# EAGLE design Lab5 (EAGLE 9.6.2)
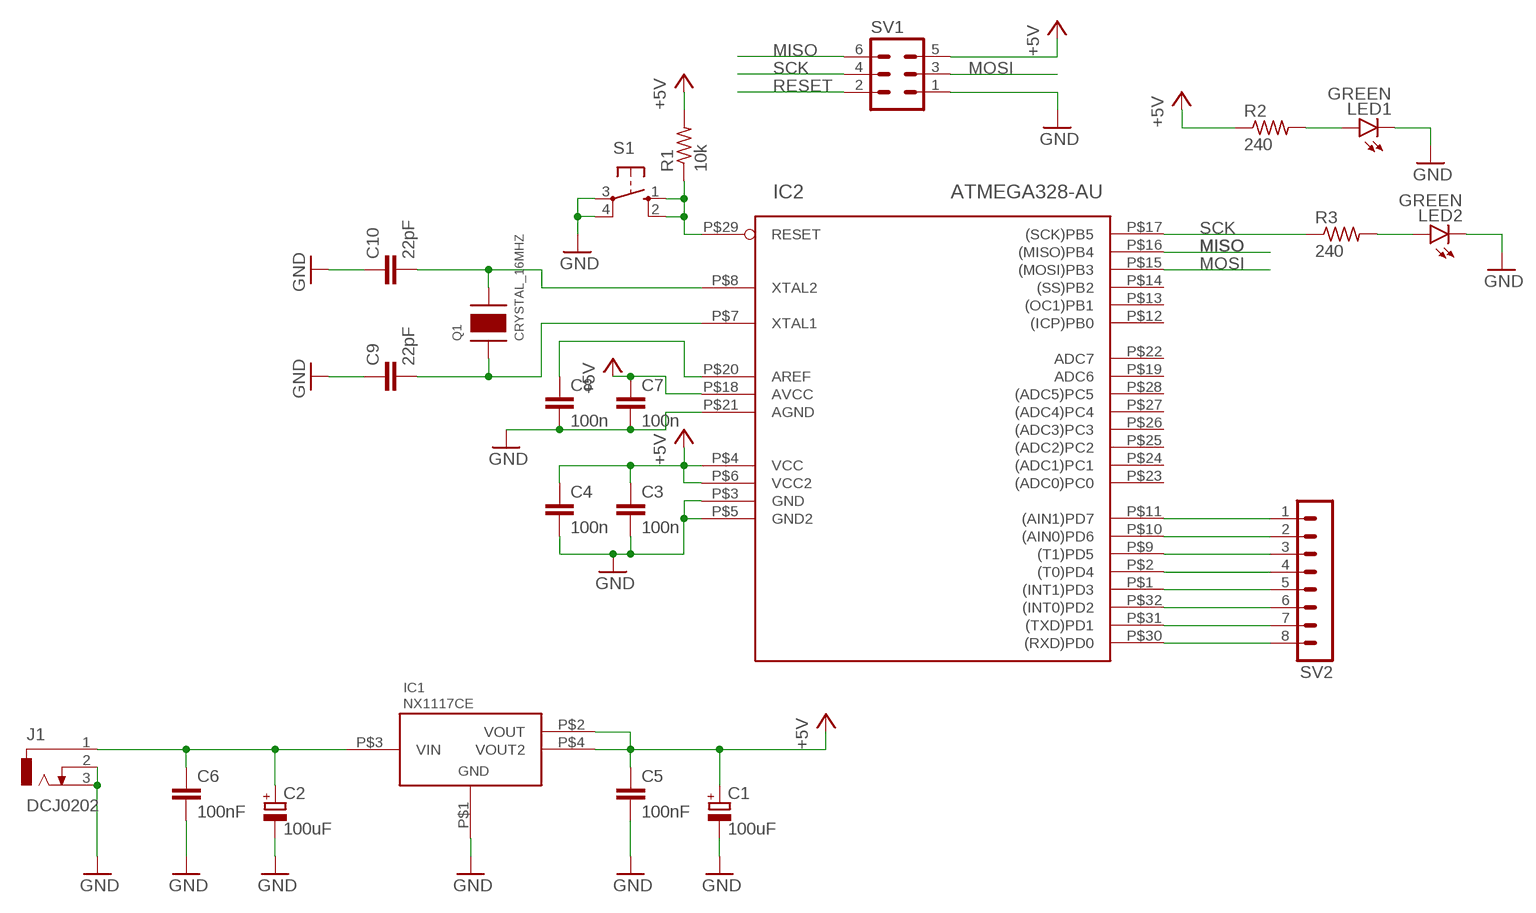
[diagram p0: schematic, sheet 1]

## Parts
C1  100uF  CPOL-EUD  [PANASONIC_D]
C2  100uF  CPOL-EUD  [PANASONIC_D]
C3  100n  C-EUC0603  [C0603]
C4  100n  C-EUC0603  [C0603]
C5  100nF  C-EUC0805  [C0805]
C6  100nF  C-EUC0805  [C0805]
C7  100n  C-EUC0603  [C0603]
C8  100n  C-EUC0603  [C0603]
C9  22pF  C-EUC0603  [C0603]
C10  22pF  C-EUC0603  [C0603]
IC1  NX1117CE  [SOT223_NX]
IC2  ATMEGA328-AU  [32-TQFP]
J1  DCJ0202  [DCJ0202]
LED1  GREEN  LEDCHIP-LED0603  [CHIP-LED0603]
LED2  GREEN  LEDCHIP-LED0603  [CHIP-LED0603]
Q1  CRYSTAL_16MHZ  [CRYSTAL_16MHZ]
R1  10k  R-US_R0603  [R0603]
R2  240  R-US_R0603  [R0603]
R3  240  R-US_R0603  [R0603]
S1  10-XX  [B3F-10XX]
SV1  MA03-2  [MA03-2]
SV2  MA08-1  [MA08-1]

## Nets
+5V: C1.+ C3.1 C4.1 C5.1 C7.1 IC1.P$2(VOUT) IC1.P$4(VOUT2) IC2.P$4(VCC) IC2.P$6(VCC2) IC2.P$18(AVCC) R1.2 R2.1 SV1.5
GND: C1.- C2.- C3.2 C4.2 C5.2 C6.2 C7.2 C8.2 C9.1 C10.1 IC1.P$1(GND) IC2.P$3(GND) IC2.P$5(GND2) IC2.P$21(AGND) J1.2 J1.3 LED1.C LED2.C S1.3(P) S1.4(P1) SV1.1
MISO: IC2.P$16((MISO)PB4) SV1.6
MOSI: IC2.P$15((MOSI)PB3) SV1.3
N$1: C2.+ C6.1 IC1.P$3(VIN) J1.1
N$2: C8.1 IC2.P$20(AREF)
N$3: C9.2 IC2.P$7(XTAL1) Q1.P$1
N$4: C10.2 IC2.P$8(XTAL2) Q1.P$2
N$5: IC2.P$29(RESET) R1.1 S1.1(S) S1.2(S1)
N$6: LED1.A R2.2
N$7: LED2.A R3.2
N$9: IC2.P$11((AIN1)PD7) SV2.1
N$10: IC2.P$10((AIN0)PD6) SV2.2
N$11: IC2.P$9((T1)PD5) SV2.3
N$12: IC2.P$2((T0)PD4) SV2.4
N$13: IC2.P$1((INT1)PD3) SV2.5
N$14: IC2.P$32((INT0)PD2) SV2.6
N$15: IC2.P$31((TXD)PD1) SV2.7
N$16: IC2.P$30((RXD)PD0) SV2.8
RESET: SV1.2
SCK: IC2.P$17((SCK)PB5) R3.1 SV1.4
Unconnected: IC2.P$12((ICP)PB0) IC2.P$13((OC1)PB1) IC2.P$14((SS)PB2) IC2.P$19(ADC6) IC2.P$22(ADC7) IC2.P$23((ADC0)PC0) IC2.P$24((ADC1)PC1) IC2.P$25((ADC2)PC2) IC2.P$26((ADC3)PC3) IC2.P$27((ADC4)PC4) IC2.P$28((ADC5)PC5)

## Library data of the parts
C1 C2 = rcl:CPOL-EU: POLARIZED CAPACITOR, European symbol; SPICEPREFIX: C
C3-C10 = rcl:C-EU: CAPACITOR, European symbol; SPICEPREFIX: C
IC1 = SPLAB:NX1117CE; DIGIKEY: MC33269DT-5.0GOS-ND
IC2 = SPLAB:ATMEGA328-AU; DIGIKEY: ATMEGA328-AU-ND
J1 = con-jack:DCJ0202: DC POWER JACK Source: DCJ0202.pdf; OC_FARNELL: unknown; OC_NEWARK: unknown
LED1 LED2 = led:LED: LED OSRAM: - CHIPLED LG R971, LG N971, LY N971, LG Q971, LY Q971, LO R971, LY R971 LH N974, LH R974 LS Q976, LO Q976, LY Q976 LO Q996 - Hyper CHIPLED LW Q18S LB Q993, LB Q99A, LB R99A - SideLED LS A670, LO A670, LY A670, LG A670, LP A670 LB A673, LV A673, LT A673, LW A673 LH A674 LY A675 LS A676, LA A676, LO A676, LY A676, LW A676 LS A679, LY A679, LG A679 - Hyper Micro SIDELED® LS Y876, LA Y876, LO Y876, LY Y876 LT Y87S - SmartLED LW L88C, LW L88S LB L89C, LB L89S, LG L890 LS L89K, LO L89K, LY L89K LS L896, LA L896, LO L896, LY L896 - TOPLED LS T670, LO T670, LY T670, LG T670, LP T670 LSG T670, LSP T670, LSY T670, LOP T670, LYG T670 LG T671, LOG T671, LSG T671 LB T673, LV T673, LT T673, LW T673 LH T674 LS T676, LA T676, LO T676, LY T676, LB T676, LH T676, LSB T676, LW T676 LB T67C, LV T67C, LT T67C, LS T67K, LO T67K, LY T67K, LW E67C LS E67B, LA E67B, LO E67B, LY E67B, LB E67C, LV E67C, LT E67C LW T67C LS T679, LY T679, LG T679 LS T770, LO T770, LY T770, LG T770, LP T770 LB T773, LV T773, LT T773, LW T773 LH T774 LS E675, LA E675, LY E675, LS T675 LS T776, LA T776, LO T776, LY T776, LB T776 LHGB T686 LT T68C, LB T68C - Hyper Mini TOPLED® LB M676 - Mini TOPLED Santana® LG M470 LS M47K, LO M47K, LY M47K Source: http://www.osram.convergy.de LUXEON: - LUMILED® LXK2-PW12-R00, LXK2-PW12-S00, LXK2-PW14-U00, LXK2-PW14-V00 LXK2-PM12-R00, LXK2-PM12-S00, LXK2-PM14-U00 LXK2-PE12-Q00, LXK2-PE12-R00, LXK2-PE12-S00, LXK2-PE14-T00, LXK2-PE14-U00 LXK2-PB12-K00, LXK2-PB12-L00, LXK2-PB12-M00, LXK2-PB14-N00, LXK2-PB14-P00, LXK2-PB14-Q00 LXK2-PR12-L00, LXK2-PR12-M00, LXK2-PR14-Q00, LXK2-PR14-R00 LXK2-PD12-Q00, LXK2-PD12-R00, LXK2-PD12-S00 LXK2-PH12-R00, LXK2-PH12-S00 LXK2-PL12-P00, LXK2-PL12-Q00, LXK2-PL12-R00 Source: www.luxeon.com KINGBRIGHT: KA-3528ASYC Source: www.kingbright.com
Q1 = SPLAB:CRYSTAL_16MHZ
R1-R3 = rcl:R-US_: RESISTOR, American symbol; SPICEPREFIX: R
S1 = switch-omron:10-XX: OMRON SWITCH; MPN: B3F-1000; OC_FARNELL: 176432; OC_NEWARK: 36M3542
SV1 = con-lstb:MA03-2: PIN HEADER; OC_FARNELL: unknown; OC_NEWARK: unknown
SV2 = con-lstb:MA08-1: PIN HEADER; OC_FARNELL: unknown; OC_NEWARK: unknown

## Board
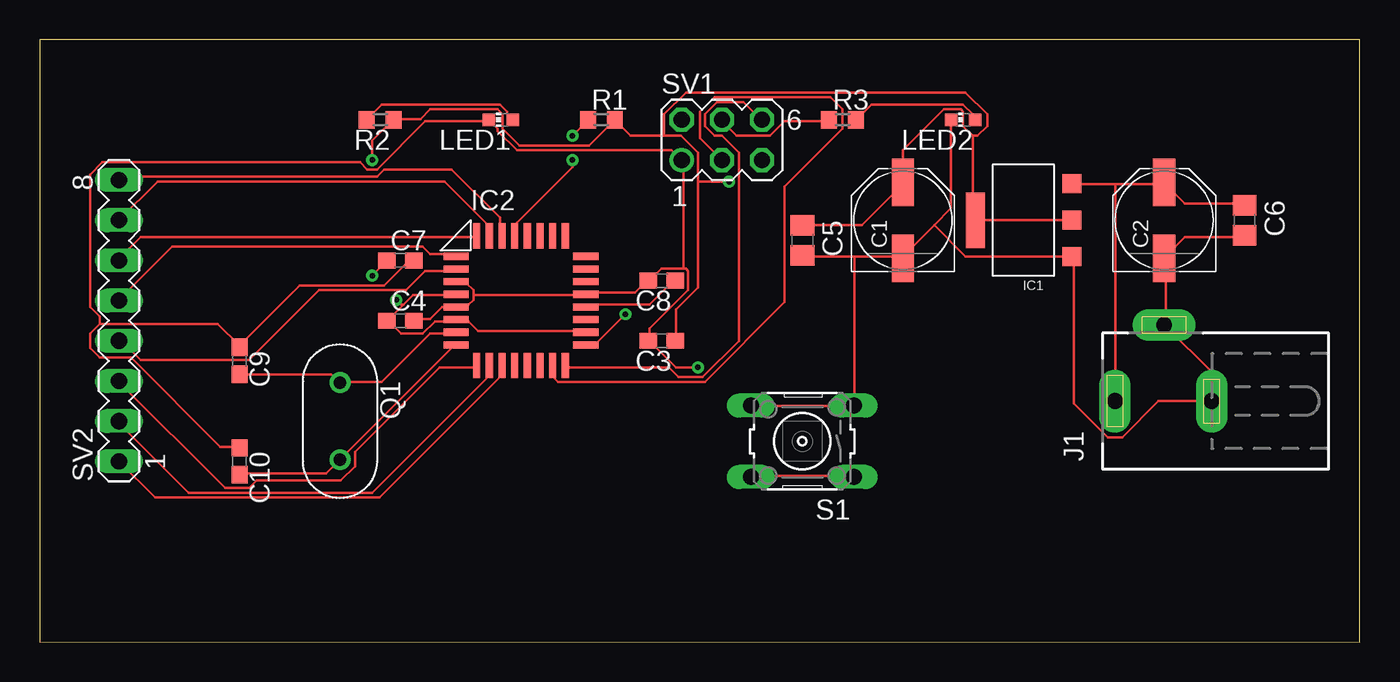
[diagram p1: board, top side]
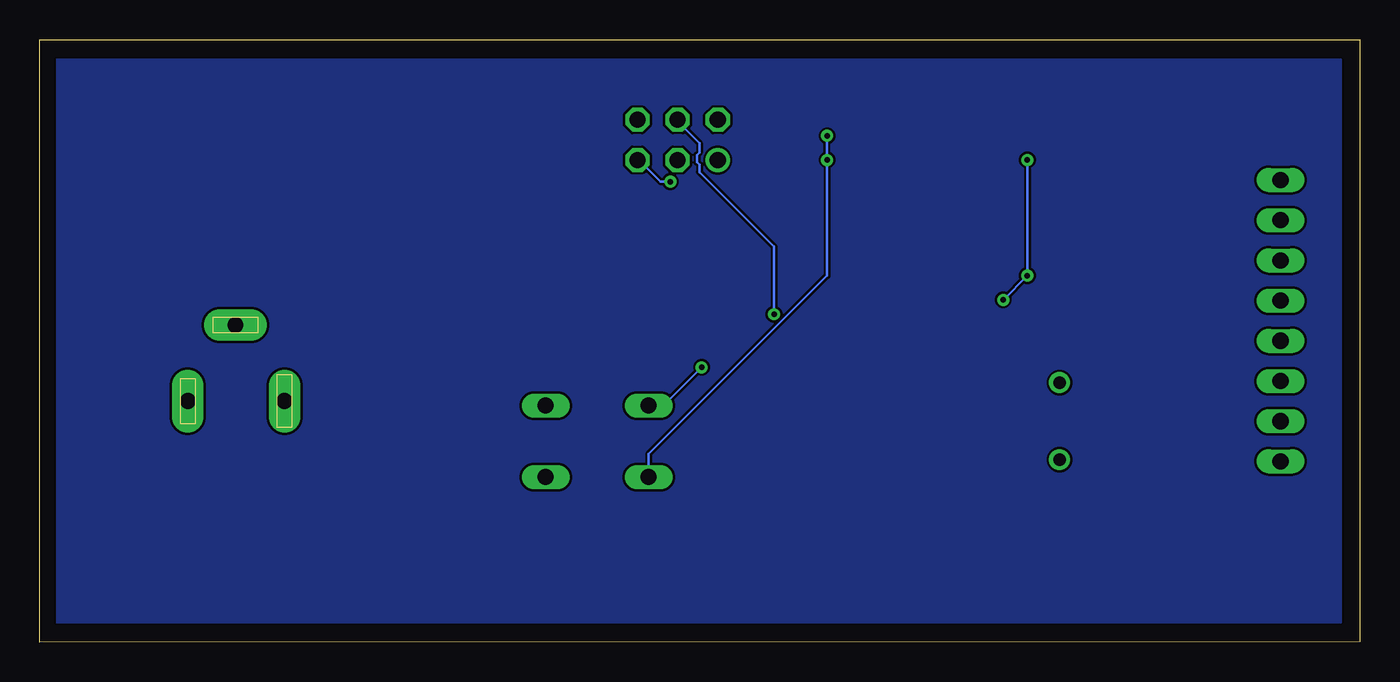
[diagram p2: board, bottom side, seen from below]

Size 83.42 x 38.09 mm. Coordinates in mm from the lower left corner, seen from the top.
Outline: 0,0.03 83.42,0 83.42,38.09 0,38.09 0,0.03
Copper layers (1*16): Top 0.035mm / dielectric 1.5mm / Bottom 0.035mm
Design rules "default": minimum track width 6mil, minimum drill 0.35mm, track to track 6mil, track to pad 6mil, pad to pad 6mil, via to via 6mil, smd to smd 6mil, copper to edge 40mil, drill to drill 6mil, minimum pad ring 10mil, minimum via ring 8mil, stop-mask expansion 4mil, vias tented up to drill 0mil, thermal gap 10mil

### Footprints (pad centres in the part's own frame; a part is rotated, then mirrored left to right if it is on the bottom)
PANASONIC_D = smd 3 x 1.4: + 2.4,0; - -2.4,0
C0603 = smd 1.1 x 1: 1 -0.85,0; 2 0.85,0
C0805 = smd 1.3 x 1.5: 1 -0.95,0; 2 0.95,0
SOT223_NX = smd 1.2 x 1.2: P$1 -2.3,-3.05; P$2 0,-3.05; P$3 2.3,-3.05 | smd 3.5 x 1.2: P$4 0,3.05
32-TQFP = smd 1.6 x 0.45: P$1 -4.1,2.8; P$2 -4.1,2; P$3 -4.1,1.2; P$4 -4.1,0.4; P$5 -4.1,-0.4; P$6 -4.1,-1.2; P$7 -4.1,-2; P$8 -4.1,-2.8; P$17 4.1,-2.8; P$18 4.1,-2; P$19 4.1,-1.2; P$20 4.1,-0.4; P$21 4.1,0.4; P$22 4.1,1.2; P$23 4.1,2; P$24 4.1,2.8 | smd 0.45 x 1.6: P$9 -2.8,-4.1; P$10 -2,-4.1; P$11 -1.2,-4.1; P$12 -0.4,-4.1; P$13 0.4,-4.1; P$14 1.2,-4.1; P$15 2,-4.1; P$16 2.8,-4.1; P$25 2.8,4.1; P$26 2,4.1; P$27 1.2,4.1; P$28 0.4,4.1; P$29 -0.4,4.1; P$30 -1.2,4.1; P$31 -2,4.1; P$32 -2.8,4.1
DCJ0202 = drill 1 pad 2 long: 1 0,3.1; 2 4.8,0; 3 0,-3
CHIP-LED0603 = smd 0.8 x 0.8: A 0,-0.75; C 0,0.75
CRYSTAL_16MHZ = drill 0.8: P$1 -2.44,0; P$2 2.44,0
R0603 = smd 1 x 1.1: 1 -0.85,0; 2 0.85,0
B3F-10XX = drill 1.016 long: 1 -3.251,2.261; 2 3.251,2.261; 3 -3.251,-2.261; 4 3.251,-2.261
MA03-2 = drill 1.016: 1 -2.54,-1.27 | drill 1.016 octagon: 2 -2.54,1.27; 3 0,-1.27; 4 0,1.27; 5 2.54,-1.27; 6 2.54,1.27
MA08-1 = drill 1.016 long: 1 -8.89,0; 2 -6.35,0; 3 -3.81,0; 4 -1.27,0; 5 1.27,0; 6 3.81,0; 7 6.35,0; 8 8.89,0

### Placement (x,y rotation side)
C1  54.54,26.67 90 top
C2  71.05,26.67 90 top
C3  39.3,19.05 180 top
C4  22.79,20.32 0 top
C5  48.19,25.4 270 top
C6  76.13,26.67 270 top
C7  22.79,24.13 0 top
C8  39.3,22.86 180 top
C9  12.63,17.78 270 top
C10  12.63,11.43 270 top
IC1  62.16,26.67 90 top
IC2  30.41,21.59 0 top
J1  71.05,15.24 90 top
LED1  29.14,33.02 90 top
LED2  58.35,33.02 90 top
Q1  18.98,13.97 270 top
R1  35.49,33.02 0 top
R2  21.52,33.02 180 top
R3  50.73,33.02 0 top
S1  48.19,12.7 180 top
SV1  43.11,31.75 0 top
SV2  5.01,20.32 90 top

### Tracks (layer width: path | path; a pad name or v marks a point on that pad's centre or on a via)
+5V  (via drill 0.35)
  Top 0.152: IC1.P$2 IC1.P$4 58.96,26.67 58.96,32 | C5.1 48.3,26.37 51.95,26.37 54.54,28.96 C1.+ 54.54,31.09 57.13,33.68 58.2,33.68 58.35,33.53 58.35,32.61 58.96,32 | 23,21.34 23.61,21.95 26.2,21.95 IC2.P$4 | 23,21.34 22.08,20.42 C4.1 22.08,20.27 22.84,19.51 24.22,19.51 24.98,20.27 26.2,20.27 IC2.P$6 26.35,20.27 27.11,20.27 27.72,19.66 34.43,19.66 IC2.P$18 | v21.02,23.16 21.93,24.08 C7.1 | v22.54,21.64 22.84,21.34 23,21.34 | 41.59,29.11 41.59,30.94 40.52,32 39.46,32 | 41.59,29.11 41.59,22.4 40.22,21.03 40.22,19.05 C3.1 | 39.46,32 37.32,32 36.41,32.92 R1.2 36.26,32.92 34.73,31.39 30.31,31.39 29.25,32.46 29.25,33.38 28.94,33.68 24.67,33.68 24.06,33.07 22.39,33.07 R2.1 22.23,32.92 21.02,31.7 v21.02,30.48 | 41.59,29.11 v43.57,29.11 | 58.96,32 59.27,32 59.88,32.61 59.88,33.38 58.51,34.75 40.83,34.75 39.46,33.38 39.46,32
  Bottom 0.152: v22.54,21.64 v21.02,23.16 v21.02,30.48 | v43.57,29.11 44.18,29.11 45.55,30.48 SV1.5
GND  (via drill 0.35)
  Top 0.152: C6.2 76.03,25.6 72.37,25.6 71.16,24.38 C2.- 71.16,24.23 71.16,20.12 J1.2 71.16,19.96 74.05,17.07 J1.3 | S1.4 44.94,14.94 51.34,14.94 S1.3 51.5,15.09 51.5,24.38 | 54.54,24.38 56.52,26.37 | 56.52,26.37 57.59,27.43 57.59,32.92 LED2.C | 56.52,26.37 58.51,24.38 65.21,24.38 IC1.P$1 65.36,24.23 65.36,15.09 67.5,12.95 68.41,12.95 70.7,15.24 J1.3 | 54.54,24.38 51.5,24.38 | 51.5,24.38 48.3,24.38 C5.2 | 54.54,24.38 C1.- | J1.3 | 3.79,20.12 3.18,19.51 3.18,18.59 3.79,17.98 5.78,17.98 11.41,12.34 12.63,12.34 C10.1 | 3.79,20.12 11.26,20.12 12.63,18.75 | 12.63,18.75 16.44,22.55 21.78,22.55 23.3,24.08 23.61,24.08 C7.2 | 12.63,18.75 C9.1 | C4.2 23.76,20.42 24.67,20.42 25.44,21.18 26.2,21.18 IC2.P$5 26.35,21.34 27.11,21.34 27.42,21.64 27.42,21.95 | 27.42,21.95 27.42,22.25 26.96,22.71 26.35,22.71 IC2.P$3 | 38.54,19.05 38.54,19.81 40.98,22.25 40.98,23.47 40.83,23.62 40.68,23.62 | 40.68,23.62 39.3,23.62 38.54,22.86 C8.2 38.39,22.86 37.63,22.1 34.58,22.1 IC2.P$21 34.43,21.95 27.42,21.95 | 40.68,23.62 40.68,30.48 SV1.1 40.52,30.48 39.91,31.09 30.16,31.09 28.94,32.31 28.94,32.46 28.48,32.92 LED1.C 28.33,32.92 24.37,32.92 21.32,29.87 20.71,29.87 20.25,30.33 3.95,30.33 3.18,29.57 3.18,21.18 3.79,20.57 3.79,20.12 | v41.59,17.37 40.22,17.37 38.54,19.05 | 38.54,19.05 C3.2
  Bottom 0.152: v41.59,17.37 43.88,15.09 44.94,15.09 S1.4
MISO
  Top 0.152: IC2.P$16 33.36,17.37 39.76,17.37 40.37,16.76 41.89,16.76 44.18,19.05 44.18,30.94 43.11,32 42.66,32 42.05,32.61 42.05,33.38 42.81,34.14 44.49,34.14 45.55,33.07 SV1.6
MOSI
  Top 0.152: SV1.3 41.74,31.85 41.74,33.53 42.66,34.44 49.97,34.44 50.73,33.68 50.73,32.46 47.08,28.8 47.08,21.49 42.05,16.46 32.75,16.46 32.45,16.76 32.45,17.37 IC2.P$15
N$1
  Top 0.152: 67.95,28.96 71,28.96 C2.+ 71.16,28.96 72.37,27.74 76.03,27.74 C6.1 | 67.95,28.96 65.36,28.96 IC1.P$3 | 67.95,28.96 J1.1
N$2
  Top 0.152: C8.1 40.07,22.86 38.54,21.34 34.58,21.34 IC2.P$20
N$3
  Top 0.152: C9.2 12.63,16.92 18.42,16.92 18.88,16.46 Q1.P$1 19.03,16.46 21.63,16.46 24.67,19.51 26.2,19.51 IC2.P$7
N$4
  Top 0.152: C10.2 12.63,10.67 18.12,10.67 18.88,11.43 Q1.P$2 19.03,11.58 26.2,18.75 IC2.P$8
N$5  (via drill 0.35)
  Top 0.152: S1.2 44.94,10.52 51.34,10.52 S1.1 | v33.66,32 34.58,32.92 R1.1 | v33.66,30.48 33.66,30.02 30.16,26.52 30.16,25.76 IC2.P$29
  Bottom 0.152: v33.66,32 v33.66,30.48 33.66,23.16 44.94,11.89 S1.2
N$6
  Top 0.152: LED1.A 29.85,33.07 29.55,33.38 29.55,33.53 29.09,33.98 21.63,33.98 20.71,33.07 R2.2
N$7
  Top 0.152: LED2.A 58.96,33.07 58.96,33.38 58.35,33.98 52.56,33.98 51.65,33.07 R3.2
N$9
  Top 0.152: SV2.1 7.3,9.14 21.47,9.14 29.09,16.76 29.09,17.37 IC2.P$11
N$10
  Top 0.152: IC2.P$10 28.33,17.37 28.33,16.76 21.02,9.45 9.43,9.45 5.01,13.87 SV2.2
N$11
  Top 0.152: IC2.P$9 27.57,17.37 25.28,17.37 19.95,12.04 19.95,11.12 19.03,10.21 13.7,10.21 13.24,9.75 11.72,9.75 5.01,16.46 SV2.3
N$12
  Top 0.152: SV2.4 5.17,19.05 6.39,17.83 13.24,17.83 17.66,22.25 23.15,22.25 24.37,23.47 26.2,23.47 IC2.P$2
N$13
  Top 0.152: IC2.P$1 26.2,24.54 24.67,24.54 24.22,24.99 8.37,24.99 5.01,21.64 SV2.5
N$14
  Top 0.152: IC2.P$32 27.57,25.6 6.39,25.6 5.01,24.23 SV2.6
N$15
  Top 0.152: SV2.7 7.45,29.11 25.59,29.11 28.33,26.37 28.33,25.76 IC2.P$31
N$16
  Top 0.152: IC2.P$30 29.09,25.76 29.09,26.82 26.04,29.87 21.78,29.87 21.32,29.41 5.17,29.41 5.01,29.26 SV2.8
POL
  pour Bottom: 82.48,1.27 82.48,36.83 1.2,36.83 1.2,1.27
SCK  (via drill 0.35)
  Top 0.152: R3.1 49.82,32.92 47.08,32.92 46.16,32 44.03,32 43.11,32.92 SV1.4 | v37.02,20.73 35.19,18.9 34.58,18.9 IC2.P$17
  Bottom 0.152: v37.02,20.73 37.02,24.99 41.74,29.72 41.74,30.18 41.89,30.33 41.89,30.79 41.74,30.94 41.74,31.55 43.11,32.92 SV1.4